# Altium schematic sheet dc_aux.SchDoc
size A4; SheetNumber: 4; SheetTotal: 4
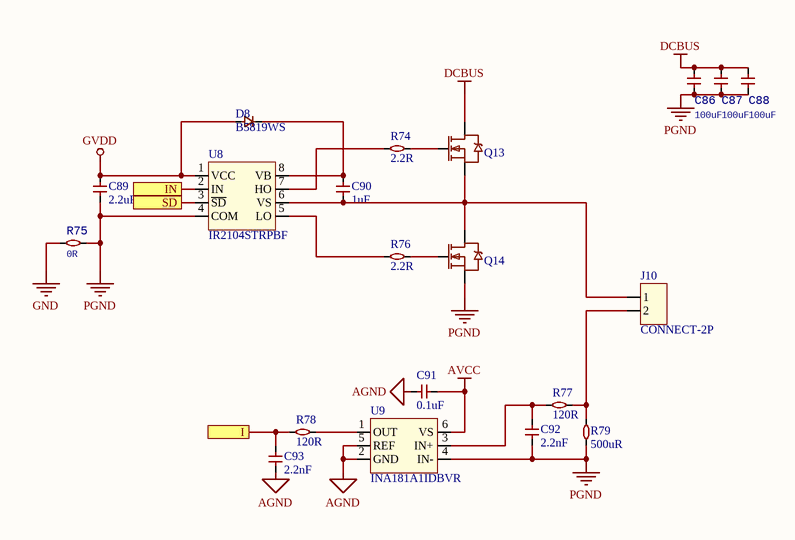
[diagram p0: dc_aux.SchDoc]

## Parts
C86  100uF  [C1206]
C87  100uF  [C1206]
C88  100uF  [C1206]
C89  2.2uF  [C0402]
C90  1uF  [C0402]
C91  0.1uF  [C0402]
C92  2.2nF  [C0402]
C93  2.2nF  [C0402]
D8  B5819WS  [SOD-323]
J10  CONNECT-2P  [CONNECT-2P]
Q13  AP68N06G  [SOT-23-3]  (value not drawn)
Q14  AP68N06G  [SOT-23-3]  (value not drawn)
R74  2.2R  [R0402]
R75  0R  [R0402]
R76  2.2R  [R0402]
R77  120R  [R0402]
R78  120R  [R0402]
R79  500uR  [R2512]
U8  IR2104STRPBF  [SOIC-8]
U9  INA181A1IDBVR  [SOT-23-6]

## Ports
I (see main[8C]), IN (see main[7B]), SD (see main[7C])

## Nets
AGND: C91.1 C93.1 U9.2(GND) U9.5(REF)
AVCC: C91.2 U9.6(VS)
DCBUS: C86.1 C87.1 C88.1 Q13.3(D)
GND: R75.1
GVDD: C89.1 D8.2 U8.1(VCC)
PGND: C86.2 C87.2 C88.2 C89.2 C92.2 Q14.2(S) R75.2 R79.2 U8.4(COM) U9.4(IN-)
I: C93.2 R78.1 ; port I
IN: U8.2(IN) ; port IN
SD: U8.3(~{SD}) ; port SD
NetC90_1: C90.1 D8.1 U8.8(VB)
NetC90_2: C90.2 J10.1 Q13.2(S) Q14.3(D) U8.6(VS)
NetC92_1: C92.1 R77.1 U9.3(IN+)
NetJ10_2: J10.2 R77.2 R79.1
NetQ13_1: Q13.1(G) R74.2
NetQ14_1: Q14.1(G) R76.2
NetR74_1: R74.1 U8.7(HO)
NetR76_1: R76.1 U8.5(LO)
NetR78_2: R78.2 U9.1(OUT)

## Library data of the parts
C86-C93 = CAP: 贴片电容; Manufacturer: SAMSUNG(三星); Manufacturer Part: CL05A105KP5NNND; Add into BOM: yes; Tolerance: ±10%; Voltage Rated: 10V; Temperature Coefficient: X5R; Symbol: CAP-0402; Device: cap-0402; LCSC Part Name: 1uF ±10% 10V; Supplier Part: C307414; Supplier Footprint: 0402; JLCPCB Part Class: Extended Part; Datasheet: https://atta.szlcsc.com/upload/public/pdf/source/20181009/C307414_0A02B57115E94FED95F0CB1E32115BFC.pdf; Supplier: LCSC; Convert to PCB: yes
D8 = DIO: 通用二极管; Manufacturer: SAMSUNG(三星); Manufacturer Part: CL05A105KP5NNND; Add into BOM: yes; Tolerance: ±10%; Voltage Rated: 10V; Temperature Coefficient: X5R; Symbol: CAP-0402; Device: cap-0402; LCSC Part Name: 1uF ±10% 10V; Supplier Part: C307414; Supplier Footprint: 0402; JLCPCB Part Class: Extended Part; Datasheet: https://atta.szlcsc.com/upload/public/pdf/source/20181009/C307414_0A02B57115E94FED95F0CB1E32115BFC.pdf; Supplier: LCSC; Convert to PCB: yes
J10 = CONNECT-2P: 连接器
Q13 Q14 = NMOS: N沟道功率mos管; Manufacturer: BORN(伯恩半导体); Name: AO3401A; Symbol: AO3401A_C306862; Add into BOM: yes; Type: P沟道; Drain Source Voltage (Vdss): 30V; Continuous Drain Current (Id): 4.2A; Power Dissipation (Pd): 1.4W; Drain Source On Resistance (RDS(on)@Vgs,Id): 50mΩ@10V,4.1A; Gate Threshold Voltage (Vgs(th)@Id): 2V@250uA; Device: AO3401A_C306862; LCSC Part Name: P沟道 30V 4.2A; Supplier Part: C306862; Manufacturer Part: AO3401A; Supplier Footprint: SOT-23; JLCPCB Part Class: 扩展库; Datasheet: https://atta.szlcsc.com/upload/public/pdf/source/20190514/C306862_F7EF2FFF49BA48EA0D342955B5285B33.pdf; Supplier: LCSC; Convert to PCB: yes
R74 R76 R77 = RES: 贴片电阻0603; Manufacturer: UNI-ROYAL(厚声); Manufacturer Part: 0402WGF1001TCE; Add into BOM: yes; Tolerance: ±1%; Power(Watts): 1/16W; Temperature Coefficient: ±100ppm/; Overload Voltage (Max): 50V; Symbol: RES-0402; Device: res-0402; LCSC Part Name: 1k ±1%; Supplier Part: C11702; Supplier Footprint: 0402; Datasheet: https://atta.szlcsc.com/upload/public/pdf/source/20200306/C422600_1E6D84923E4A46A82E41ADD87F860B5C.pdf; Supplier: LCSC; Convert to PCB: yes; Type: 厚膜电阻; Operating Temperature Range: -55~+155; JLCPCB Part Class: 基础库
R75 R78 = RES: 贴片电阻; Manufacturer: UNI-ROYAL(厚声); Manufacturer Part: 0402WGF1001TCE; Add into BOM: yes; Tolerance: ±1%; Power(Watts): 1/16W; Temperature Coefficient: ±100ppm/; Overload Voltage (Max): 50V; Symbol: RES-0402; Device: res-0402; LCSC Part Name: 1k ±1%; Supplier Part: C11702; Supplier Footprint: 0402; Datasheet: https://atta.szlcsc.com/upload/public/pdf/source/20200306/C422600_1E6D84923E4A46A82E41ADD87F860B5C.pdf; Supplier: LCSC; Convert to PCB: yes; Type: 厚膜电阻; Operating Temperature Range: -55~+155; JLCPCB Part Class: 基础库
R79 = RES: 贴片电阻 / 2512; Manufacturer: UNI-ROYAL(厚声); Manufacturer Part: 0402WGF1001TCE; Add into BOM: yes; Tolerance: ±1%; Power(Watts): 1/16W; Temperature Coefficient: ±100ppm/; Overload Voltage (Max): 50V; Symbol: RES-0402; Device: res-0402; LCSC Part Name: 1k ±1%; Supplier Part: C11702; Supplier Footprint: 0402; Datasheet: https://atta.szlcsc.com/upload/public/pdf/source/20200306/C422600_1E6D84923E4A46A82E41ADD87F860B5C.pdf; Supplier: LCSC; Convert to PCB: yes; Type: 厚膜电阻; Operating Temperature Range: -55~+155; JLCPCB Part Class: 基础库
U8 = IR2104STRPBF: 栅极驱动IC / Infineon / SOP-8
U9 = INA181Ax: 电流感应放大器 / TI(德州仪器)